# EAGLE schematic PC104 (EAGLE 7.4.0)

## Sheet 1 of 5
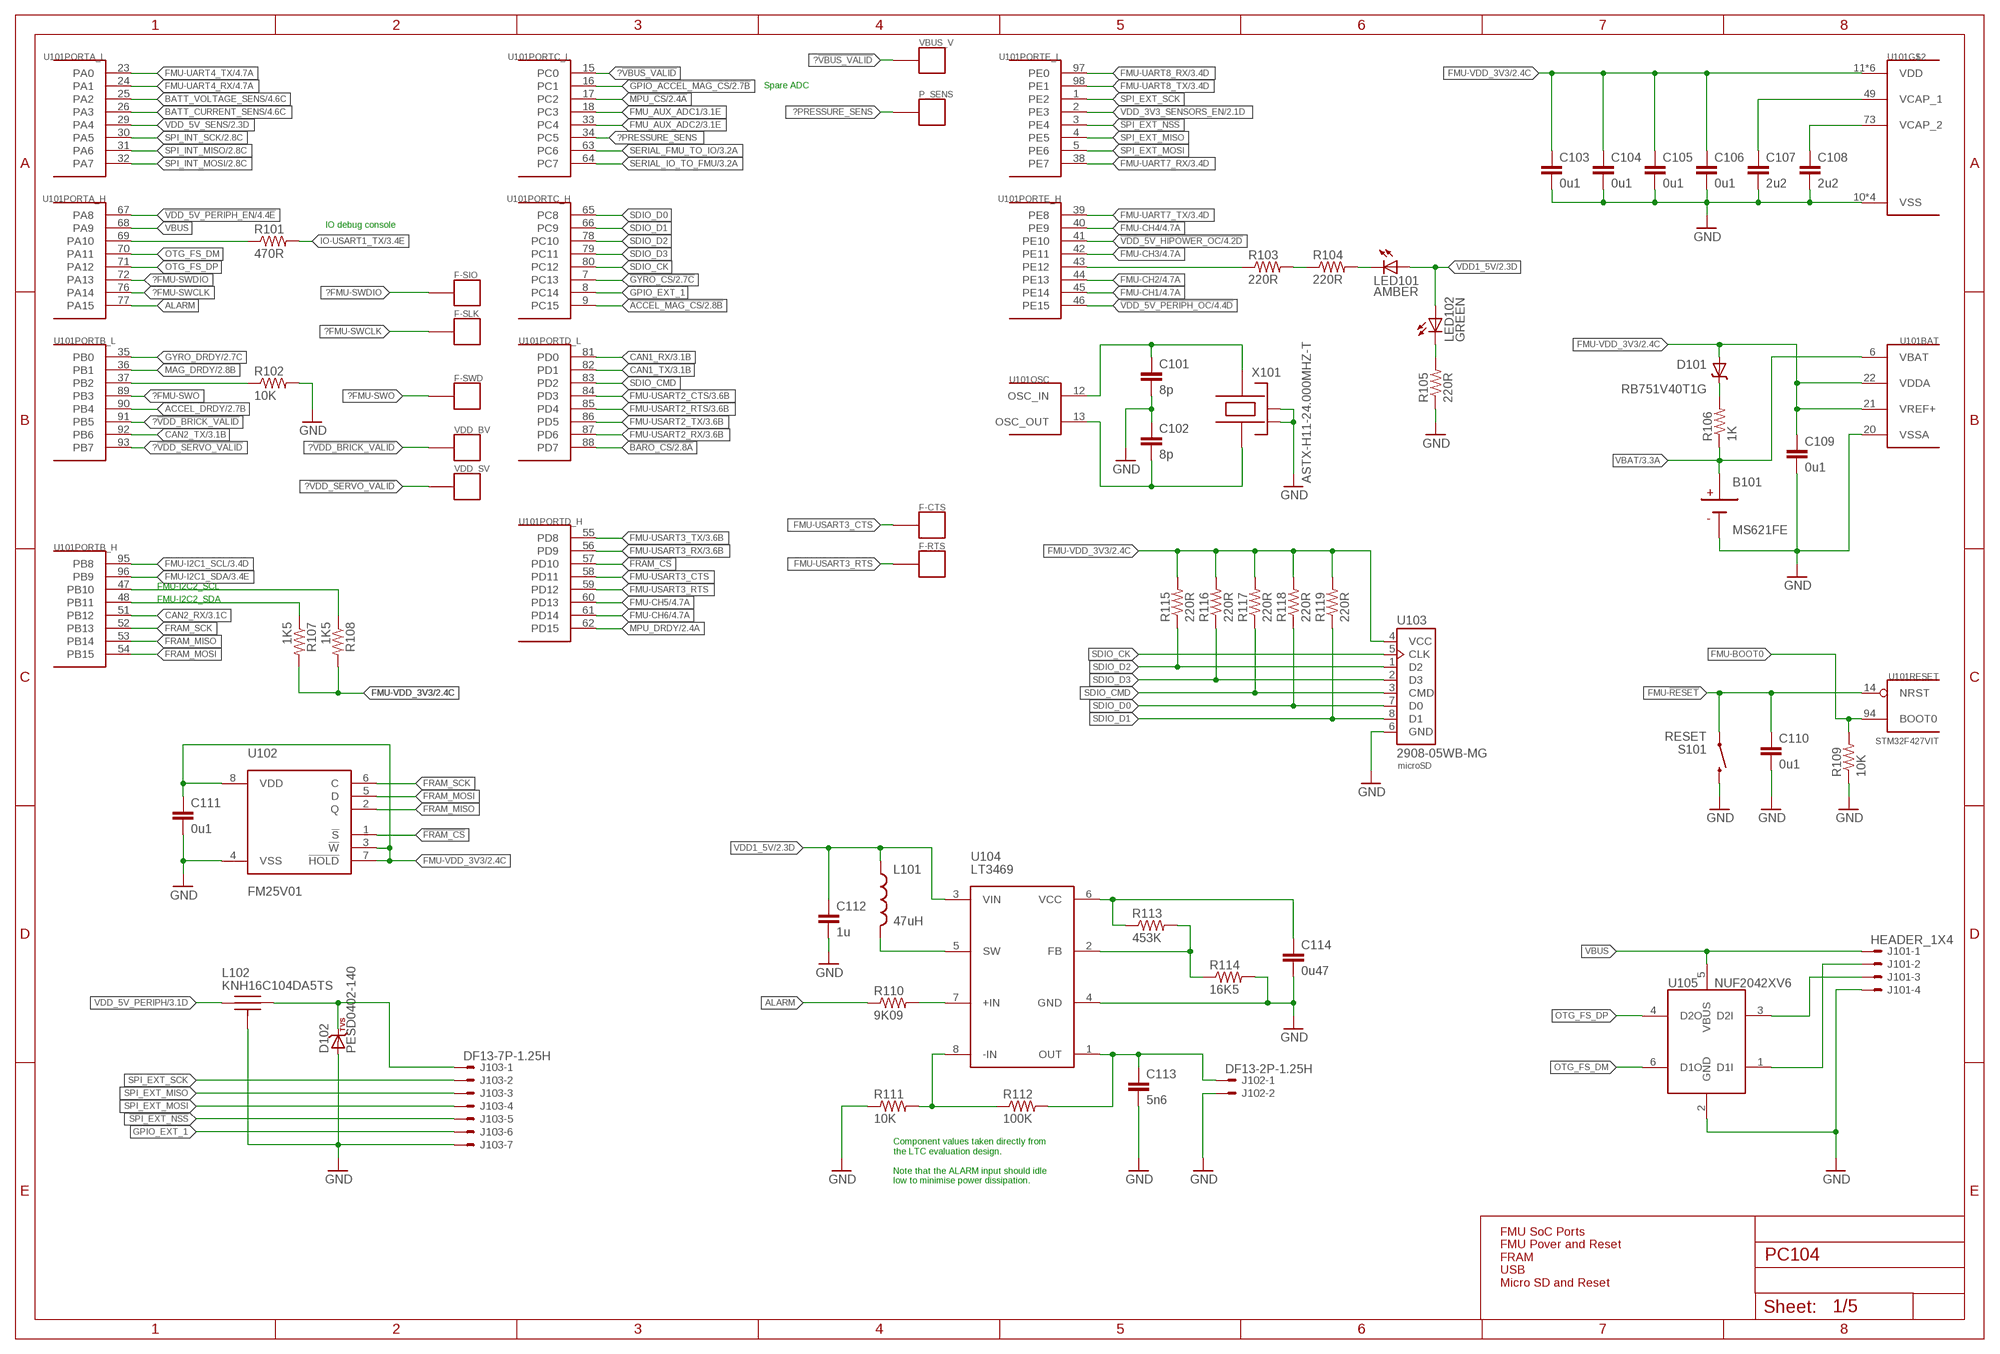
[diagram p0: schematic, sheet 1]

### Parts
B101  MS621FE  [MS621FE]
C101  8p  CAP0603  [0603-CAP]
C102  8p  CAP0603  [0603-CAP]
C103  0u1  CAP0603  [0603-CAP]
C104  0u1  CAP0603  [0603-CAP]
C105  0u1  CAP0603  [0603-CAP]
C106  0u1  CAP0603  [0603-CAP]
C107  2u2  CAP0603  [0603-CAP]
C108  2u2  CAP0603  [0603-CAP]
C109  0u1  CAP0603  [0603-CAP]
C110  0u1  CAP0603  [0603-CAP]
C111  0u1  CAP0603  [0603-CAP]
C112  1u  CAP0603  [0603-CAP]
C113  5n6  CAP0603  [0603-CAP]
C114  0u47  CAP0603  [0603-CAP]
D101  RB751V40T1G  DIODE-SCHOTTKY_SOD323  [SOD323]
D102  PESD0402-140  DIODE-TVS  [0402-TVS]
F-CTS  PAD.04  [PAD.04X.04]
F-RTS  PAD.04  [PAD.04X.04]
F-SIO  PAD.04  [PAD.04X.04]
F-SLK  PAD.04  [PAD.04X.04]
F-SWD  PAD.04  [PAD.04X.04]
J101  HEADER_1X4  [HEADER_2.54MM-1X04]
J102  DF13-2P-1.25H  [DF13A-2P-1.25H]
J103  DF13-7P-1.25H  [DF13A-7P-1.25H]
L101  47uH  INDUCTOR0805  [0805-IND]
L102  KNH16C104DA5TS  [KYOCERA-KNH16-DA]
LED101  AMBER  LED0603  [0603-LED]
LED102  GREEN  LED0603  [0603-LED]
P_SENS  PAD.04  [PAD.04X.04]
R101  470R  RESISTOR0603-RES  [0603-RES]
R102  10K  RESISTOR0603-RES  [0603-RES]
R103  220R  RESISTOR0603-RES  [0603-RES]
R104  220R  RESISTOR0603-RES  [0603-RES]
R105  220R  RESISTOR0603-RES  [0603-RES]
R106  1K  RESISTOR0603-RES  [0603-RES]
R107  1K5  RESISTOR0603-RES  [0603-RES]
R108  1K5  RESISTOR0603-RES  [0603-RES]
R109  10K  RESISTOR0603-RES  [0603-RES]
R110  9K09  RESISTOR0603-RES  [0603-RES]
R111  10K  RESISTOR0603-RES  [0603-RES]
R112  100K  RESISTOR0603-RES  [0603-RES]
R113  453K  RESISTOR0603-RES  [0603-RES]
R114  16K5  RESISTOR0603-RES  [0603-RES]
R115  220R  RESISTOR0603-RES  [0603-RES]
R116  220R  RESISTOR0603-RES  [0603-RES]
R117  220R  RESISTOR0603-RES  [0603-RES]
R118  220R  RESISTOR0603-RES  [0603-RES]
R119  220R  RESISTOR0603-RES  [0603-RES]
S101  RESET  SWITCH-MOMENTARY-2  [EVQP7J01K]
U101  STM32F427VIT  STM32F4X7VX  [TQFP100]
U102  FM25V01  [SO08]
U103  2908-05WB-MG  MICROSDSDI  [MICROSD]
U104  LT3469  [SOT23-8]
U105  NUF2042XV6  [SOT563-6]
VBUS_V  PAD.04  [PAD.04X.04]
VDD_BV  PAD.04  [PAD.04X.04]
VDD_SV  PAD.04  [PAD.04X.04]
X101  ASTX-H11-24.000MHZ-T  OSCILLATOR-3.2X2.5  [OSCILLATOR-3.2X2.5]

### Nets
!ACCEL_MAG_CS: U101.9(PORTC_H:PC15) ; also sheet 2
!BARO_CS: U101.88(PORTD_L:PD7) ; also sheet 2
!FRAM_CS: U101.57(PORTD_H:PD10) U102.1(!S)
!GPIO_ACCEL_MAG_CS: U101.16(PORTC_L:PC1) ; also sheet 2
!GYRO_CS: U101.7(PORTC_H:PC13) ; also sheet 2
!MPU_CS: U101.17(PORTC_L:PC2) ; also sheet 2
!SPI_EXT_NSS: J103.5 U101.3(PORTE_L:PE4)
!VDD_5V_HIPOWER_OC: U101.41(PORTE_H:PE10) ; also sheet 4
!VDD_5V_PERIPH_EN: U101.67(PORTA_H:PA8) ; also sheet 4
!VDD_5V_PERIPH_OC: U101.46(PORTE_H:PE15) ; also sheet 4
?!VBUS_VALID: U101.15(PORTC_L:PC0) VBUS_V.P$1
?!VDD_BRICK_VALID: U101.91(PORTB_L:PB5) VDD_BV.P$1
?!VDD_SERVO_VALID: U101.93(PORTB_L:PB7) VDD_SV.P$1
?FMU-SWCLK: F-SLK.P$1 U101.76(PORTA_H:PA14)
?FMU-SWDIO: F-SIO.P$1 U101.72(PORTA_H:PA13)
?FMU-SWO: F-SWD.P$1 U101.89(PORTB_L:PB3)
?PRESSURE_SENS: P_SENS.P$1 U101.34(PORTC_L:PC5)
ACCEL_DRDY: U101.90(PORTB_L:PB4) ; also sheet 2
ALARM: R110.1 U101.77(PORTA_H:PA15)
BATT_CURRENT_SENS: U101.26(PORTA_L:PA3) ; also sheet 4
BATT_VOLTAGE_SENS: U101.25(PORTA_L:PA2) ; also sheet 4
CAN1_RX: U101.81(PORTD_L:PD0) ; also sheet 3
CAN1_TX: U101.82(PORTD_L:PD1) ; also sheet 3
CAN2_RX: U101.51(PORTB_H:PB12) ; also sheet 3
CAN2_TX: U101.92(PORTB_L:PB6) ; also sheet 3
FMU-!RESET: C110.P$1 S101.A1 U101.14(RESET:NRST)
FMU-BOOT0: R109.2 U101.94(RESET:BOOT0)
FMU-CH1: U101.45(PORTE_H:PE14) ; also sheet 4
FMU-CH2: U101.44(PORTE_H:PE13) ; also sheet 4
FMU-CH3: U101.42(PORTE_H:PE11) ; also sheet 4
FMU-CH4: U101.40(PORTE_H:PE9) ; also sheet 4
FMU-CH5: U101.60(PORTD_H:PD13) ; also sheet 4
FMU-CH6: U101.61(PORTD_H:PD14) ; also sheet 4
FMU-I2C1_SCL: U101.95(PORTB_H:PB8) ; also sheet 3
FMU-I2C1_SDA: U101.96(PORTB_H:PB9) ; also sheet 3
FMU-UART4_RX: U101.24(PORTA_L:PA1) ; also sheet 4
FMU-UART4_TX: U101.23(PORTA_L:PA0) ; also sheet 4
FMU-UART7_RX: U101.38(PORTE_L:PE7) ; also sheet 3
FMU-UART7_TX: U101.39(PORTE_H:PE8) ; also sheet 3
FMU-UART8_RX: U101.97(PORTE_L:PE0) ; also sheet 3
FMU-UART8_TX: U101.98(PORTE_L:PE1) ; also sheet 3
FMU-USART2_CTS: U101.84(PORTD_L:PD3) ; also sheet 3
FMU-USART2_RTS: U101.85(PORTD_L:PD4) ; also sheet 3
FMU-USART2_RX: U101.87(PORTD_L:PD6) ; also sheet 3
FMU-USART2_TX: U101.86(PORTD_L:PD5) ; also sheet 3
FMU-USART3_CTS: F-CTS.P$1 U101.58(PORTD_H:PD11)
FMU-USART3_RTS: F-RTS.P$1 U101.59(PORTD_H:PD12)
FMU-USART3_RX: U101.56(PORTD_H:PD9) ; also sheet 3
FMU-USART3_TX: U101.55(PORTD_H:PD8) ; also sheet 3
FMU-VDD_3V3 [GND1]: C103.P$1 C104.P$1 C105.P$1 C106.P$1 C109.P$1 C111.P$1 D101.A R107.2 R108.2 R115.2 R116.2 R117.2 R118.2 R119.2 U101.11(VDD) U101.19(VDD) U101.21(BAT:VREF+) U101.22(BAT:VDDA) U101.28(VDD) U101.50(VDD) U101.75(VDD) U101.100(VDD) U102.3(!W) U102.7(!HOLD) U102.8(VDD) U103.4(VCC) ; also sheet 2,3,4
FMU_AUX_ADC1: U101.18(PORTC_L:PC3) ; also sheet 3
FMU_AUX_ADC2: U101.33(PORTC_L:PC4) ; also sheet 3
FRAM_MISO: U101.53(PORTB_H:PB14) U102.2(Q)
FRAM_MOSI: U101.54(PORTB_H:PB15) U102.5(D)
FRAM_SCK: U101.52(PORTB_H:PB13) U102.6(C)
GND: B101.2(NEG) C101.P$2 C102.P$1 C103.P$2 C104.P$2 C105.P$2 C106.P$2 C107.P$2 C108.P$2 C109.P$2 C110.P$2 C111.P$2 C112.P$2 C113.P$2 C114.P$2 D102.A J101.4 J102.2 J103.7 L102.P$3 L102.P$4 L102.P$5 R102.2 R105.1 R109.1 R111.1 R114.2 S101.B3 U101.10(VSS) U101.20(BAT:VSSA) U101.27(VSS) U101.74(VSS) U101.99(VSS) U102.4(VSS) U103.6(GND) U104.4(GND) U105.2(GND) X101.2(NC_2) X101.4(NC_4) ; also sheet 2,3,4
GPIO_EXT_1: J103.6 U101.8(PORTC_H:PC14)
GYRO_DRDY: U101.35(PORTB_L:PB0) ; also sheet 2
IO-USART1_TX: R101.2 ; also sheet 3
MAG_DRDY: U101.36(PORTB_L:PB1) ; also sheet 2
MPU_DRDY: U101.62(PORTD_H:PD15) ; also sheet 2
N$1: J101.3 U105.3(D2I)
N$2: C108.P$1 U101.73(VCAP_2)
N$3: C102.P$2 U101.13(OSC:OSC_OUT) X101.1
N$4: C101.P$1 U101.12(OSC:OSC_IN) X101.3
N$5: C107.P$1 U101.49(VCAP_1)
N$6: J101.2 U105.1(D1I)
N$7: R101.1 U101.69(PORTA_H:PA10)
N$9: D101.C R106.2
N$10: R102.1 U101.37(PORTB_L:PB2)
N$14: R103.1 U101.43(PORTE_H:PE12)
N$29: C114.P$1 R113.1 U104.6(VCC)
N$30: R113.2 R114.1 U104.2(FB)
N$32: L101.P$2 U104.5(SW)
N$41: R103.2 R104.1
N$42: LED101.C R104.2
N$43: LED102.C R105.2
N$48: R111.2 R112.1 U104.8(-IN)
N$49: C113.P$1 J102.1 R112.2 U104.1(OUT)
N$52: R110.2 U104.7(+IN)
N$63: R108.1 U101.47(PORTB_H:PB10)
N$64: R107.1 U101.48(PORTB_H:PB11)
N$67: D102.C J103.1 L102.P$2
OTG_FS_DM: U101.70(PORTA_H:PA11) U105.6(D1O)
OTG_FS_DP: U101.71(PORTA_H:PA12) U105.4(D2O)
SDIO_CK: U101.80(PORTC_H:PC12) U103.5(CLK)
SDIO_CMD: R117.1 U101.83(PORTD_L:PD2) U103.3(CMD)
SDIO_D0: R118.1 U101.65(PORTC_H:PC8) U103.7(D0)
SDIO_D1: R119.1 U101.66(PORTC_H:PC9) U103.8(D1)
SDIO_D2: R115.1 U101.78(PORTC_H:PC10) U103.1(D2)
SDIO_D3: R116.1 U101.79(PORTC_H:PC11) U103.2(D3)
SERIAL_FMU_TO_IO: U101.63(PORTC_L:PC6) ; also sheet 3
SERIAL_IO_TO_FMU: U101.64(PORTC_L:PC7) ; also sheet 3
SPI_EXT_MISO: J103.3 U101.4(PORTE_L:PE5)
SPI_EXT_MOSI: J103.4 U101.5(PORTE_L:PE6)
SPI_EXT_SCK: J103.2 U101.1(PORTE_L:PE2)
SPI_INT_MISO: U101.31(PORTA_L:PA6) ; also sheet 2
SPI_INT_MOSI: U101.32(PORTA_L:PA7) ; also sheet 2
SPI_INT_SCK: U101.30(PORTA_L:PA5) ; also sheet 2
VBAT: B101.1(POS) R106.1 U101.6(BAT:VBAT) ; also sheet 3
VBUS: J101.1 U101.68(PORTA_H:PA9) U105.5(VBUS)
VDD1_5V: C112.P$1 L101.P$1 LED101.A LED102.A U104.3(VIN) ; also sheet 2,3,4
VDD_3V3_SENSORS_EN: U101.2(PORTE_L:PE3) ; also sheet 2
VDD_5V_PERIPH: L102.P$1 ; also sheet 3,4
VDD_5V_SENS: U101.29(PORTA_L:PA4) ; also sheet 2

### Notes on the sheet
- Spare ADC
- IO debug console
- FMU-I2C2_SCL
- FMU-I2C2_SDA
- microSD
- Component values taken directly from
  the LTC evaluation design.
  
  Note that the ALARM input should idle
  low to minimise power dissipation.
- FMU SoC Ports
  FMU Pover and Reset
  FRAM
  USB
  Micro SD and Reset

## Sheet 2 of 5
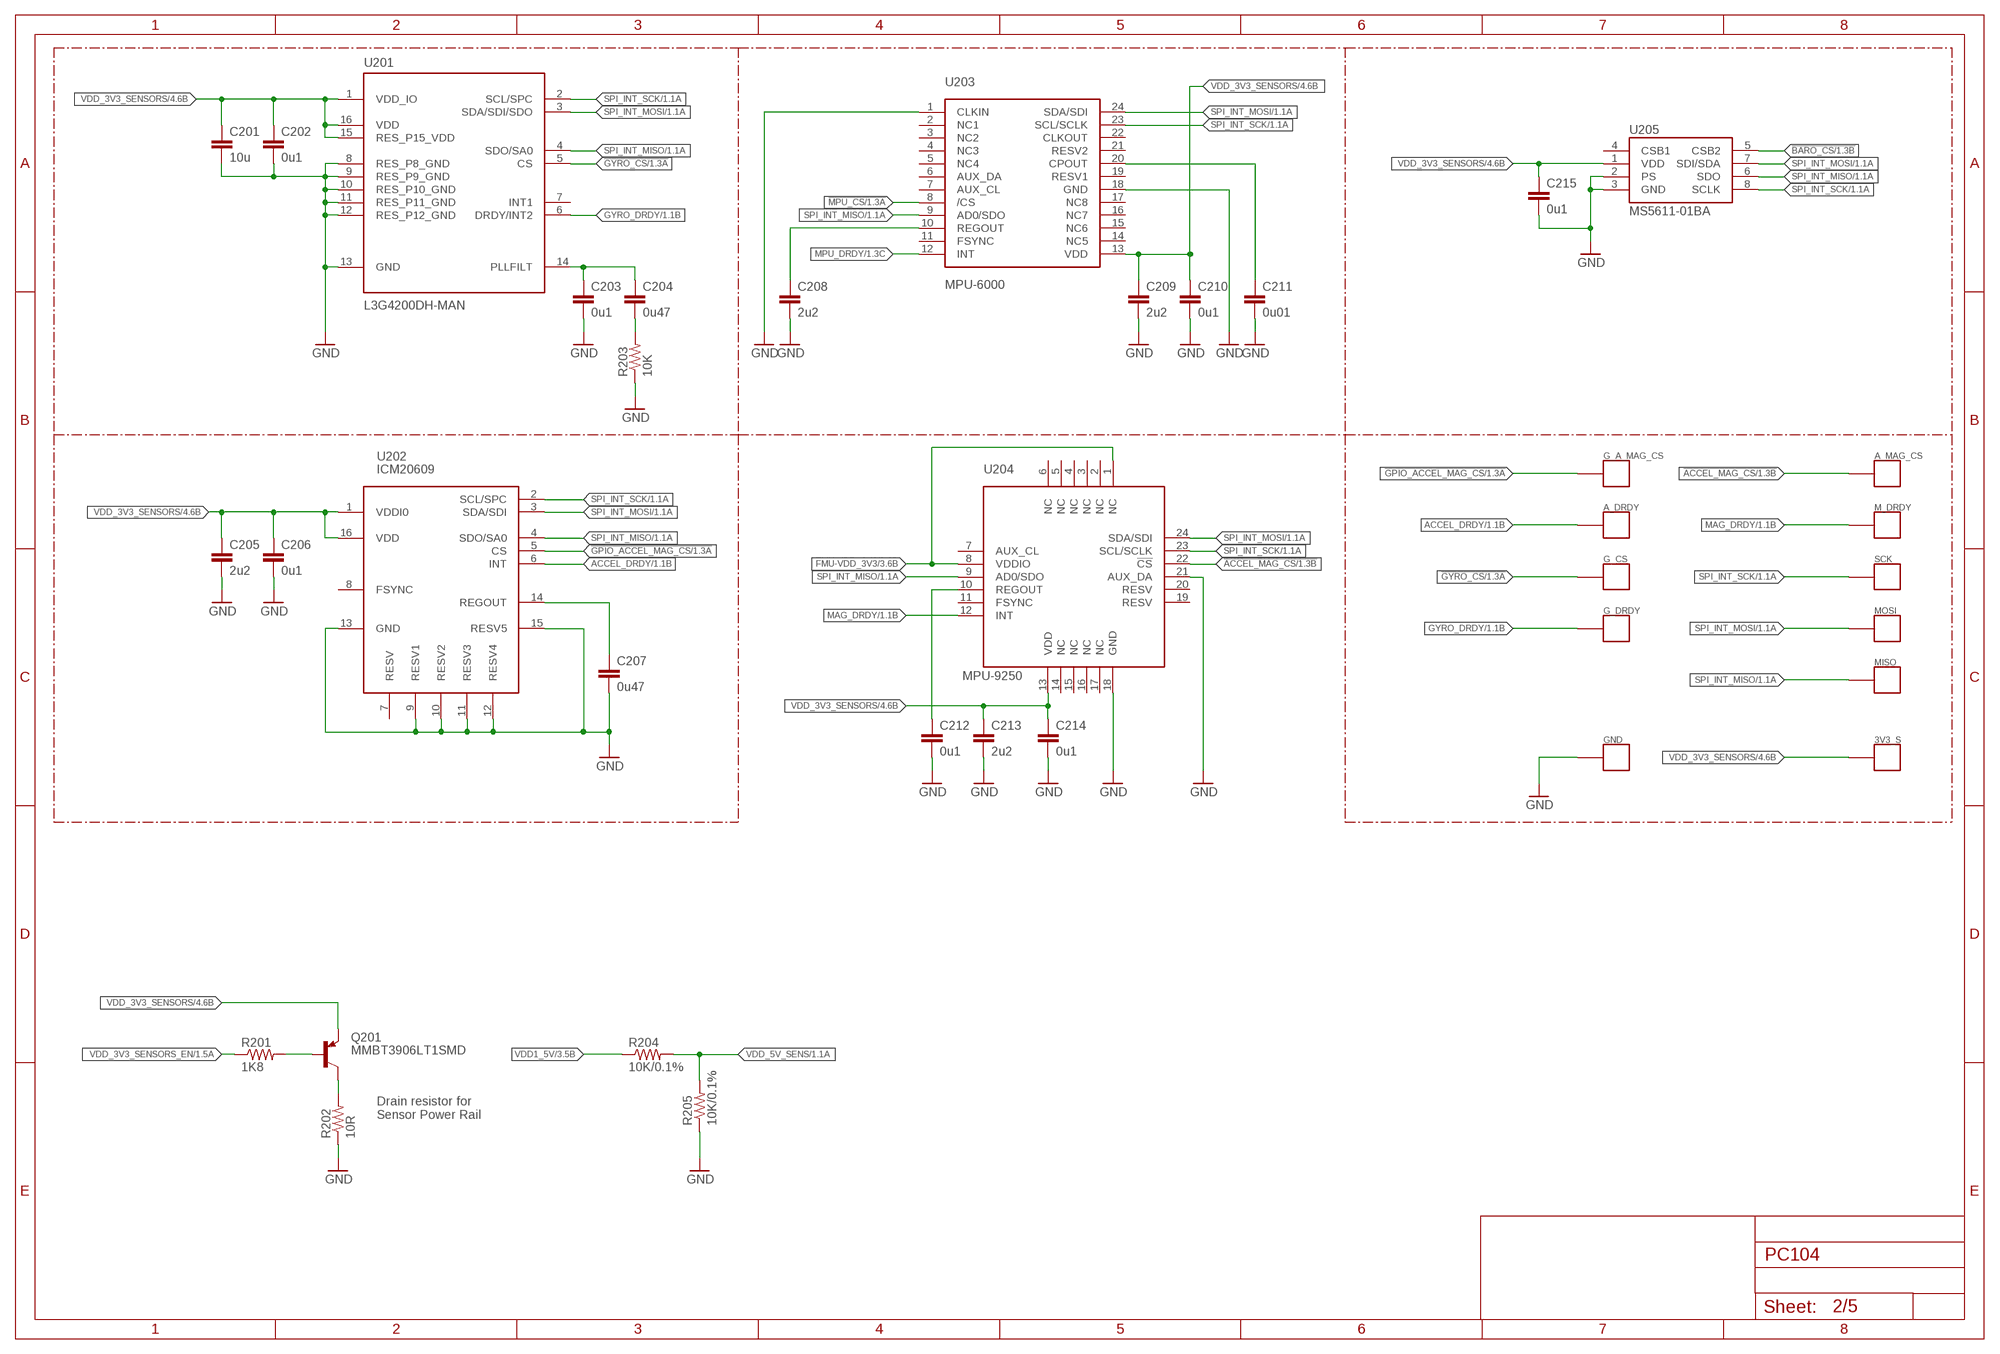
[diagram p1: schematic, sheet 2]

### Parts
3V3_S  PAD.04  [PAD.04X.04]
A_DRDY  PAD.04  [PAD.04X.04]
A_MAG_CS  PAD.04  [PAD.04X.04]
C201  10u  CAP0805  [0805-CAP]
C202  0u1  CAP0603  [0603-CAP]
C203  0u1  CAP0603  [0603-CAP]
C204  0u47  CAP0603  [0603-CAP]
C205  2u2  CAP0603  [0603-CAP]
C206  0u1  CAP0603  [0603-CAP]
C207  0u47  CAP0603  [0603-CAP]
C208  2u2  CAP0603  [0603-CAP]
C209  2u2  CAP0603  [0603-CAP]
C210  0u1  CAP0603  [0603-CAP]
C211  0u01  CAP0603  [0603-CAP]
C212  0u1  CAP0603  [0603-CAP]
C213  2u2  CAP0603  [0603-CAP]
C214  0u1  CAP0603  [0603-CAP]
C215  0u1  CAP0603  [0603-CAP]
G_A_MAG_CS  PAD.04  [PAD.04X.04]
G_CS  PAD.04  [PAD.04X.04]
G_DRDY  PAD.04  [PAD.04X.04]
GND  PAD.04  [PAD.04X.04]
M_DRDY  PAD.04  [PAD.04X.04]
MISO  PAD.04  [PAD.04X.04]
MOSI  PAD.04  [PAD.04X.04]
Q201  MMBT3906LT1SMD  [SOT23-BEC]
R201  1K8  RESISTOR0603-RES  [0603-RES]
R202  10R  RESISTOR0603-RES  [0603-RES]
R203  10K  RESISTOR0603-RES  [0603-RES]
R204  10K/0.1%  RESISTOR0603-RES  [0603-RES]
R205  10K/0.1%  RESISTOR0603-RES  [0603-RES]
SCK  PAD.04  [PAD.04X.04]
U201  L3G4200DH-MAN  L3G4200DH-LL  [L3G4200DH-MAN]
U202  ICM20609  ICM20609ICM20609  [LGA-16-3PX5P]
U203  MPU-6000  [QFN-24]
U204  MPU-9250  MPU-6500  [MPU-6500]
U205  MS5611-01BA  [MS5611-01BA]

### Nets
!ACCEL_MAG_CS: A_MAG_CS.P$1 U204.22(!CS) ; also sheet 1
!BARO_CS: U205.5(CSB2) ; also sheet 1
!GPIO_ACCEL_MAG_CS: G_A_MAG_CS.P$1 U202.5(CS) ; also sheet 1
!GYRO_CS: G_CS.P$1 U201.5(CS) ; also sheet 1
!MPU_CS: U203.8(/CS) ; also sheet 1
ACCEL_DRDY: A_DRDY.P$1 U202.6(INT) ; also sheet 1
FMU-VDD_3V3 [GND1]: U204.1(NC) U204.8(VDDIO) ; also sheet 1,3,4
GND: C201.P$2 C202.P$2 C203.P$2 C205.P$2 C206.P$2 C207.P$2 C208.P$2 C209.P$2 C210.P$2 C211.P$2 C212.P$2 C213.P$2 C214.P$2 C215.P$2 GND.P$1 R202.1 R203.1 R205.1 U201.8(RES_P8_GND) U201.9(RES_P9_GND) U201.10(RES_P10_GND) U201.11(RES_P11_GND) U201.12(RES_P12_GND) U201.13(GND) U202.9(RESV1) U202.10(RESV2) U202.11(RESV3) U202.12(RESV4) U202.13(GND) U202.15(RESV5) U203.1(CLKIN) U203.18(GND) U204.18(GND) U204.21(AUX_DA) U205.2(PS) U205.3(GND) ; also sheet 1,3,4
GYRO_DRDY: G_DRDY.P$1 U201.6(DRDY/INT2) ; also sheet 1
MAG_DRDY: M_DRDY.P$1 U204.12(INT) ; also sheet 1
MPU_DRDY: U203.12(INT) ; also sheet 1
N$20: C204.P$2 R203.2
N$36: Q201.B R201.2
N$40: Q201.C R202.2
N$53: C211.P$1 U203.20(CPOUT)
N$54: C203.P$1 C204.P$1 U201.14(PLLFILT)
N$55: C208.P$1 U203.10(REGOUT)
N$56: C212.P$1 U204.10(REGOUT)
N$62: C207.P$1 U202.14(REGOUT)
SPI_INT_MISO: MISO.P$1 U201.4(SDO/SA0) U202.4(SDO/SA0) U203.9(AD0/SDO) U204.9(AD0/SDO) U205.6(SDO) ; also sheet 1
SPI_INT_MOSI: MOSI.P$1 U201.3(SDA/SDI/SDO) U202.3(SDA/SDI) U203.24(SDA/SDI) U204.24(SDA/SDI) U205.7(SDI/SDA) ; also sheet 1
SPI_INT_SCK: SCK.P$1 U201.2(SCL/SPC) U202.2(SCL/SPC) U203.23(SCL/SCLK) U204.23(SCL/SCLK) U205.8(SCLK) ; also sheet 1
VDD1_5V: R204.1 ; also sheet 1,3,4
VDD_3V3_SENSORS: 3V3_S.P$1 C201.P$1 C202.P$1 C205.P$1 C206.P$1 C209.P$1 C210.P$1 C213.P$1 C214.P$1 C215.P$1 Q201.E U201.1(VDD_IO) U201.15(RES_P15_VDD) U201.16(VDD) U202.1(VDDI0) U202.16(VDD) U203.13(VDD) U204.13(VDD) U205.1(VDD) ; also sheet 4
VDD_3V3_SENSORS_EN: R201.1 ; also sheet 1
VDD_5V_SENS: R204.2 R205.2 ; also sheet 1
Unconnected: U201.7(INT1) U202.7(RESV) U202.8(FSYNC) U203.2(NC1) U203.3(NC2) U203.4(NC3) U203.5(NC4) U203.6(AUX_DA) U203.7(AUX_CL) U203.11(FSYNC) U203.14(NC5) U203.15(NC6) U203.16(NC7) U203.17(NC8) U203.19(RESV1) U203.21(RESV2) U203.22(CLKOUT) U204.2(NC) U204.3(NC) U204.4(NC) U204.5(NC) U204.6(NC) U204.7(AUX_CL) U204.11(FSYNC) U204.14(NC) U204.15(NC) U204.16(NC) U204.17(NC) U204.19(RESV) U204.20(RESV) U205.4(CSB1)

### Notes on the sheet
- Drain resistor for 
  Sensor Power Rail

## Sheet 3 of 5
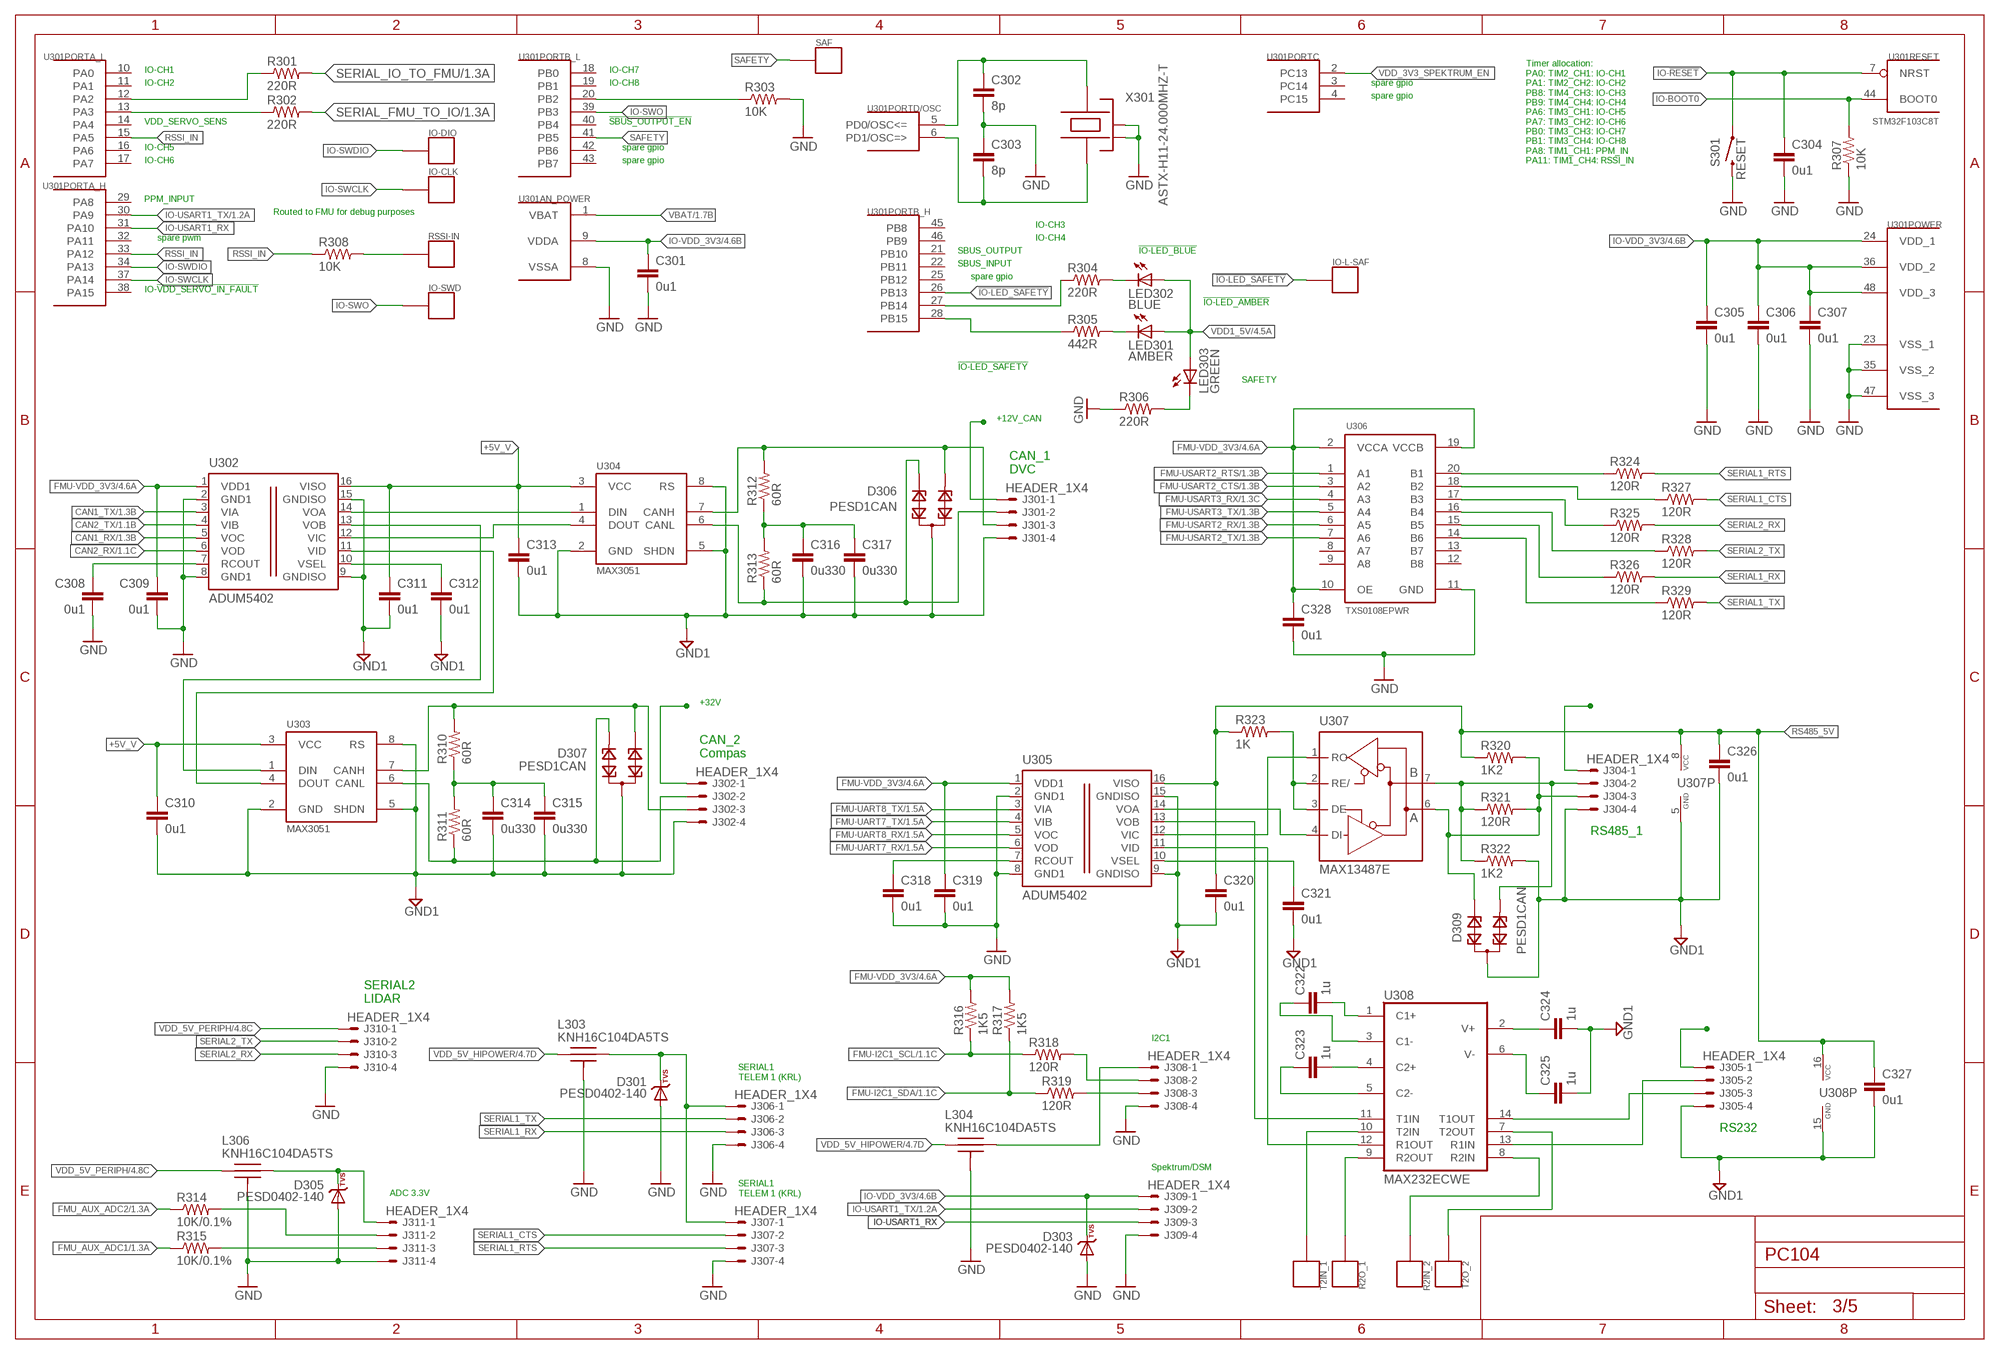
[diagram p2: schematic, sheet 3]

### Parts
C301  0u1  CAP0603  [0603-CAP]
C302  8p  CAP0603  [0603-CAP]
C303  8p  CAP0603  [0603-CAP]
C304  0u1  CAP0603  [0603-CAP]
C305  0u1  CAP0603  [0603-CAP]
C306  0u1  CAP0603  [0603-CAP]
C307  0u1  CAP0603  [0603-CAP]
C308  0u1  CAP0603  [0603-CAP]
C309  0u1  CAP0603  [0603-CAP]
C310  0u1  CAP0603  [0603-CAP]
C311  0u1  CAP0603  [0603-CAP]
C312  0u1  CAP0603  [0603-CAP]
C313  0u1  CAP0603  [0603-CAP]
C314  0u330  CAP1210  [1210]
C315  0u330  CAP1210  [1210]
C316  0u330  CAP1210  [1210]
C317  0u330  CAP1210  [1210]
C318  0u1  CAP0603  [0603-CAP]
C319  0u1  CAP0603  [0603-CAP]
C320  0u1  CAP0603  [0603-CAP]
C321  0u1  CAP0603  [0603-CAP]
C322  1u  CAP0603  [0603-CAP]
C323  1u  CAP0603  [0603-CAP]
C324  1u  CAP0603  [0603-CAP]
C325  1u  CAP0603  [0603-CAP]
C326  0u1  CAP0603  [0603-CAP]
C327  0u1  CAP0603  [0603-CAP]
C328  0u1  CAP0603  [0603-CAP]
D301  PESD0402-140  DIODE-TVS  [0402-TVS]
D303  PESD0402-140  DIODE-TVS  [0402-TVS]
D305  PESD0402-140  DIODE-TVS  [0402-TVS]
D306  PESD1CAN  [SOT23@1]
D307  PESD1CAN  [SOT23@1]
D309  PESD1CAN  [SOT23@1]
IO-CLK  PAD.04  [PAD.04X.04]
IO-DIO  TP31  PAD.04  [PAD.04X.04]
IO-L-SAF  PAD.04  [PAD.04X.04]
IO-SWD  PAD.04  [PAD.04X.04]
J301  HEADER_1X4  [HEADER_2.54MM-1X04]
J302  HEADER_1X4  [HEADER_2.54MM-1X04]
J304  HEADER_1X4  [HEADER_2.54MM-1X04]
J305  HEADER_1X4  [HEADER_2.54MM-1X04]
J306  HEADER_1X4  [HEADER_2.54MM-1X04]
J307  HEADER_1X4  [HEADER_2.54MM-1X04]
J308  HEADER_1X4  [HEADER_2.54MM-1X04]
J309  HEADER_1X4  [HEADER_2.54MM-1X04]
J310  HEADER_1X4  [HEADER_2.54MM-1X04]
J311  HEADER_1X4  [HEADER_2.54MM-1X04]
L303  KNH16C104DA5TS  [KYOCERA-KNH16-DA]
L304  KNH16C104DA5TS  [KYOCERA-KNH16-DA]
L306  KNH16C104DA5TS  [KYOCERA-KNH16-DA]
LED301  AMBER  LED0603  [0603-LED]
LED302  BLUE  LED0603  [0603-LED]
LED303  GREEN  LED0603  [0603-LED]
R2IN_2  PAD.04  [PAD.04X.04]
R2O_1  PAD.04  [PAD.04X.04]
R301  220R  RESISTOR0603-RES  [0603-RES]
R302  220R  RESISTOR0603-RES  [0603-RES]
R303  10K  RESISTOR0603-RES  [0603-RES]
R304  220R  RESISTOR0603-RES  [0603-RES]
R305  442R  RESISTOR0603-RES  [0603-RES]
R306  220R  RESISTOR0603-RES  [0603-RES]
R307  10K  RESISTOR0603-RES  [0603-RES]
R308  10K  RESISTOR0603-RES  [0603-RES]
R310  60R  RESISTOR0603-RES  [0603-RES]
R311  60R  RESISTOR0603-RES  [0603-RES]
R312  60R  RESISTOR0603-RES  [0603-RES]
R313  60R  RESISTOR0603-RES  [0603-RES]
R314  10K/0.1%  RESISTOR0603-RES  [0603-RES]
R315  10K/0.1%  RESISTOR0603-RES  [0603-RES]
R316  1K5  RESISTOR0603-RES  [0603-RES]
R317  1K5  RESISTOR0603-RES  [0603-RES]
R318  120R  RESISTOR0603-RES  [0603-RES]
R319  120R  RESISTOR0603-RES  [0603-RES]
R320  1K2  RESISTOR0603-RES  [0603-RES]
R321  120R  RESISTOR0603-RES  [0603-RES]
R322  1K2  RESISTOR0603-RES  [0603-RES]
R323  1K  RESISTOR0603-RES  [0603-RES]
R324  120R  RESISTOR0603-RES  [0603-RES]
R325  120R  RESISTOR0603-RES  [0603-RES]
R326  120R  RESISTOR0603-RES  [0603-RES]
R327  120R  RESISTOR0603-RES  [0603-RES]
R328  120R  RESISTOR0603-RES  [0603-RES]
R329  120R  RESISTOR0603-RES  [0603-RES]
RSSI-IN  PAD.04  [PAD.04X.04]
S301  RESET  SWITCH-MOMENTARY-2  [EVQP7J01K]
SAF  PAD.04  [PAD.04X.04]
T2IN_1  T2IN  PAD.04  [PAD.04X.04]
T2O_2  PAD.04  [PAD.04X.04]
U301  STM32F103C8T  STM32F10XCXT6  [TQFP48]
U302  ADUM5402  ADUM1301  [SO-16W]
U303  MAX3051  MAX3051MAX3051ESA  [SO08]
U304  MAX3051  MAX3051MAX3051ESA  [SO08]
U305  ADUM5402  ADUM1301  [SO-16W]
U306  TXS0108EPWR  TXS0108TSSOP-20  [R-PDSO-G20]
U307  MAX13487E  MAX481CSA  [SO08]
U308  MAX232ECWE  [SO16L]
X301  ASTX-H11-24.000MHZ-T  OSCILLATOR-3.2X2.5  [OSCILLATOR-3.2X2.5]

### Nets
!IO-LED_SAFETY: IO-L-SAF.P$1 U301.26(PORTB_H:PB13)
+5V: J305.1
+5V_V: C310.P$1 C311.P$1 C313.P$1 U302.16(VISO) U303.3(VCC) U304.3(VCC)
+12V: J304.1
+12V_CAN: J301.1
+32V_CAN: J302.1
CAN1_RX: U302.5(VOC) ; also sheet 1
CAN1_TX: U302.3(VIA) ; also sheet 1
CAN2_RX: U302.6(VOD) ; also sheet 1
CAN2_RX_IN: U302.11(VID) U303.4(DOUT)
CAN2_TX: U302.4(VIB) ; also sheet 1
CAN2_TX_IN: U302.13(VOB) U303.1(DIN)
FMU-I2C1_SCL: R316.1 R318.1 ; also sheet 1
FMU-I2C1_SDA: R317.1 R319.1 ; also sheet 1
FMU-UART7_RX: U305.6(VOD) ; also sheet 1
FMU-UART7_TX: U305.4(VIB) ; also sheet 1
FMU-UART8_RX: U305.5(VOC) ; also sheet 1
FMU-UART8_TX: U305.3(VIA) ; also sheet 1
FMU-USART2_CTS: U306.3(A2) ; also sheet 1
FMU-USART2_RTS: U306.1(A1) ; also sheet 1
FMU-USART2_RX: U306.6(A5) ; also sheet 1
FMU-USART2_TX: U306.7(A6) ; also sheet 1
FMU-USART3_RX: U306.4(A3) ; also sheet 1
FMU-USART3_TX: U306.5(A4) ; also sheet 1
FMU-VDD_3V3 [GND1]: C309.P$1 C319.P$1 C328.P$1 R316.2 R317.2 U302.1(VDD1) U305.1(VDD1) U306.2(VCCA) U306.10(OE) U306.19(VCCB) ; also sheet 1,2,4
FMU_AUX_ADC1: R315.1 ; also sheet 1
FMU_AUX_ADC2: R314.1 ; also sheet 1
GND: C301.P$2 C302.P$2 C303.P$1 C304.P$2 C305.P$2 C306.P$2 C307.P$2 C308.P$2 C309.P$2 C318.P$2 C319.P$2 C328.P$2 D301.A D303.A D305.A J306.4 J307.4 J308.4 J309.4 J310.4 J311.4 L303.P$3 L303.P$4 L303.P$5 L304.P$3 L304.P$4 L304.P$5 L306.P$3 L306.P$4 L306.P$5 R303.2 R306.1 R307.1 S301.B3 U301.8(AN_POWER:VSSA) U301.23(POWER:VSS_1) U301.35(POWER:VSS_2) U301.47(POWER:VSS_3) U302.2(GND1) U302.8(GND1) U305.2(GND1) U305.8(GND1) U306.11(GND) X301.2(NC_2) X301.4(NC_4) ; also sheet 1,2,4
GND1 [GND1]: C310.P$2 C311.P$2 C312.P$2 C313.P$2 C314.2 C315.2 C316.2 C317.2 C320.P$2 C321.P$2 C324.P$2 C325.P$2 C326.P$2 C327.P$2 D306.3 D307.3 D309.3 J301.4 J302.4 J304.4 J305.4 R322.2 U302.9(GNDISO) U302.15(GNDISO) U303.2(GND) U303.5(SHDN) U303.8(RS) U304.2(GND) U304.5(SHDN) U304.8(RS) U305.9(GNDISO) U305.15(GNDISO) U307.5(GND) U308.15(GND)
IO-!RESET: C304.P$1 S301.A1 U301.7(RESET:NRST)
IO-BOOT0: R307.2 U301.44(RESET:BOOT0)
IO-SWCLK: IO-CLK.P$1 U301.37(PORTA_H:PA14)
IO-SWDIO: IO-DIO.P$1 U301.34(PORTA_H:PA13)
IO-SWO: IO-SWD.P$1 U301.39(PORTB_L:PB3)
IO-USART1_RX: J309.3 U301.31(PORTA_H:PA10)
IO-USART1_TX: J309.2 U301.30(PORTA_H:PA9) ; also sheet 1
IO-VDD_3V3: C301.P$1 C305.P$1 C306.P$1 C307.P$1 D303.C J309.1 U301.9(AN_POWER:VDDA) U301.24(POWER:VDD_1) U301.36(POWER:VDD_2) U301.48(POWER:VDD_3) ; also sheet 4
N$8: R301.1 U301.12(PORTA_L:PA2)
N$11: R302.1 U301.13(PORTA_L:PA3)
N$12: R303.1 U301.20(PORTB_L:PB2)
N$13: C303.P$2 U301.6(PORTD/OSC:PD1/OSC=>) X301.1
N$16: D309.1 J304.3 R320.2 R321.2 U307.6(A)
N$17: J305.2 U308.13(R1IN)
N$18: D309.2 J304.2 R321.1 R322.1 U307.7(B)
N$19: R308.2 RSSI-IN.P$1
N$21: C308.P$1 U302.7(RCOUT)
N$24: LED303.C R306.2
N$25: J311.3 R315.2
N$26: C312.P$1 U302.10(VSEL)
N$28: D301.C J306.1 J307.1 L303.P$2
N$33: C323.P$2 U308.4(C2+)
N$34: R304.1 U301.27(PORTB_H:PB14)
N$37: C316.1 C317.1 R312.1 R313.2
N$38: J308.2 R318.2
N$39: C323.P$1 U308.5(C2-)
N$44: LED301.C R305.2
N$45: J308.3 R319.2
N$46: R305.1 U301.28(PORTB_H:PB15)
N$47: LED302.C R304.2
N$50: R328.1 U306.16(B4)
N$51: R326.1 U306.15(B5)
N$57: C322.P$2 U308.1(C1+)
N$58: C322.P$1 U308.3(C1-)
N$59: J305.3 U308.14(T1OUT)
N$60: J308.1 L304.P$2
N$61: D305.C J311.1 L306.P$2
N$65: R325.1 U306.17(B3)
N$66: R327.1 U306.18(B2)
N$68: C318.P$1 U305.7(RCOUT)
N$70: R329.1 U306.14(B6)
N$71: R324.1 U306.20(B1)
N$72: J311.2 R314.2
N$73: C321.P$1 U305.10(VSEL)
N$74: C324.P$1 U308.2(V+)
N$75: C314.1 C315.1 R310.1 R311.2
N$82: D306.1 J301.2 R313.1 U304.6(CANL)
N$83: D306.2 J301.3 R312.2 U304.7(CANH)
N$84: D307.1 J302.3 R310.2 U303.7(CANH)
N$85: D307.2 J302.2 R311.1 U303.6(CANL)
N$86: C325.P$1 U308.6(V-)
N$104: R323.2 U307.2(RE/) U307.3(DE)
N$106: T2IN_1.P$1 U308.10(T2IN)
N$110: R2O_1.P$1 U308.9(R2OUT)
N$111: T2O_2.P$1 U308.7(T2OUT)
N$127: R2IN_2.P$1 U308.8(R2IN)
N$145: U302.14(VOA) U304.1(DIN)
N$147: U302.12(VIC) U304.4(DOUT)
RS485_5V: C320.P$1 C326.P$1 C327.P$1 R320.1 R323.1 U305.16(VISO) U307.8(VCC) U308.16(VCC)
RSSI_IN: R308.1 U301.15(PORTA_L:PA5) U301.33(PORTA_H:PA12)
SAFETY: SAF.P$1 U301.41(PORTB_L:PB5)
SERIAL1_CTS: J307.2 R327.2
SERIAL1_RTS: J307.3 R324.2
SERIAL1_RX: J306.3 R326.2
SERIAL1_TX: J306.2 R329.2
SERIAL2_RX: J310.3 R325.2
SERIAL2_TX: J310.2 R328.2
SERIAL_FMU_TO_IO: R302.2 ; also sheet 1
SERIAL_IO_TO_FMU: R301.2 ; also sheet 1
VBAT: U301.1(AN_POWER:VBAT) ; also sheet 1
VDD1_5V: LED301.A LED302.A LED303.A ; also sheet 1,2,4
VDD_3V3_SPEKTRUM_EN: U301.2(PORTC:PC13)
VDD_5V_HIPOWER: L303.P$1 L304.P$1 ; also sheet 4
VDD_5V_PERIPH: J310.1 L306.P$1 ; also sheet 1,4
VIC: U305.12(VIC) U307.1(RO)
VID: U305.11(VID) U308.12(R1OUT)
VOA: U305.14(VOA) U307.4(DI)
VOB: U305.13(VOB) U308.11(T1IN)
X301: C302.P$1 U301.5(PORTD/OSC:PD0/OSC<=) X301.3
Unconnected: U301.3(PORTC:PC14) U301.4(PORTC:PC15) U301.10(PORTA_L:PA0) U301.11(PORTA_L:PA1) U301.14(PORTA_L:PA4) U301.16(PORTA_L:PA6) U301.17(PORTA_L:PA7) U301.18(PORTB_L:PB0) U301.19(PORTB_L:PB1) U301.21(PORTB_H:PB10) U301.22(PORTB_H:PB11) U301.25(PORTB_H:PB12) U301.29(PORTA_H:PA8) U301.32(PORTA_H:PA11) U301.38(PORTA_H:PA15) U301.40(PORTB_L:PB4) U301.42(PORTB_L:PB6) U301.43(PORTB_L:PB7) U301.45(PORTB_H:PB8) U301.46(PORTB_H:PB9) U306.8(A7) U306.9(A8) U306.12(B8) U306.13(B7)

### Notes on the sheet
- IO-CH1 | IO-CH7
- IO-CH2 | IO-CH8 | spare gpio
- spare gpio
- VDD_SERVO_SENS | !SBUS_OUTPUT_EN
- IO-CH5 | spare gpio
- IO-CH6 | spare gpio
- Timer allocation:
  PA0: TIM2_CH1: IO-CH1
  PA1: TIM2_CH2: IO-CH2
  PB8: TIM4_CH3: IO-CH3
  PB9: TIM4_CH4: IO-CH4
  PA6: TIM3_CH1: IO-CH5
  PA7: TIM3_CH2: IO-CH6
  PB0: TIM3_CH3: IO-CH7
  PB1: TIM3_CH4: IO-CH8
  PA8: TIM1_CH1: PPM_IN
  PA11: TIM1_CH4: RSSI_IN
- PPM_INPUT
- Routed to FMU for debug purposes
- IO-CH3
- spare pwm | IO-CH4
- SBUS_OUTPUT | !IO-LED_BLUE
- SBUS_INPUT
- spare gpio
- IO-!VDD_SERVO_IN_FAULT
- !IO-LED_AMBER
- !IO-LED_SAFETY
- SAFETY
- +12V_CAN
- CAN_1
  DVC
- +32V
- CAN_2
  Compas
- RS485_1
- SERIAL2
  LIDAR
- I2C1
- SERIAL1
  TELEM 1 (KRL)
- RS232
- Spektrum/DSM
- ADC 3.3V
- SERIAL1
  TELEM 1 (KRL)

## Sheet 4 of 5
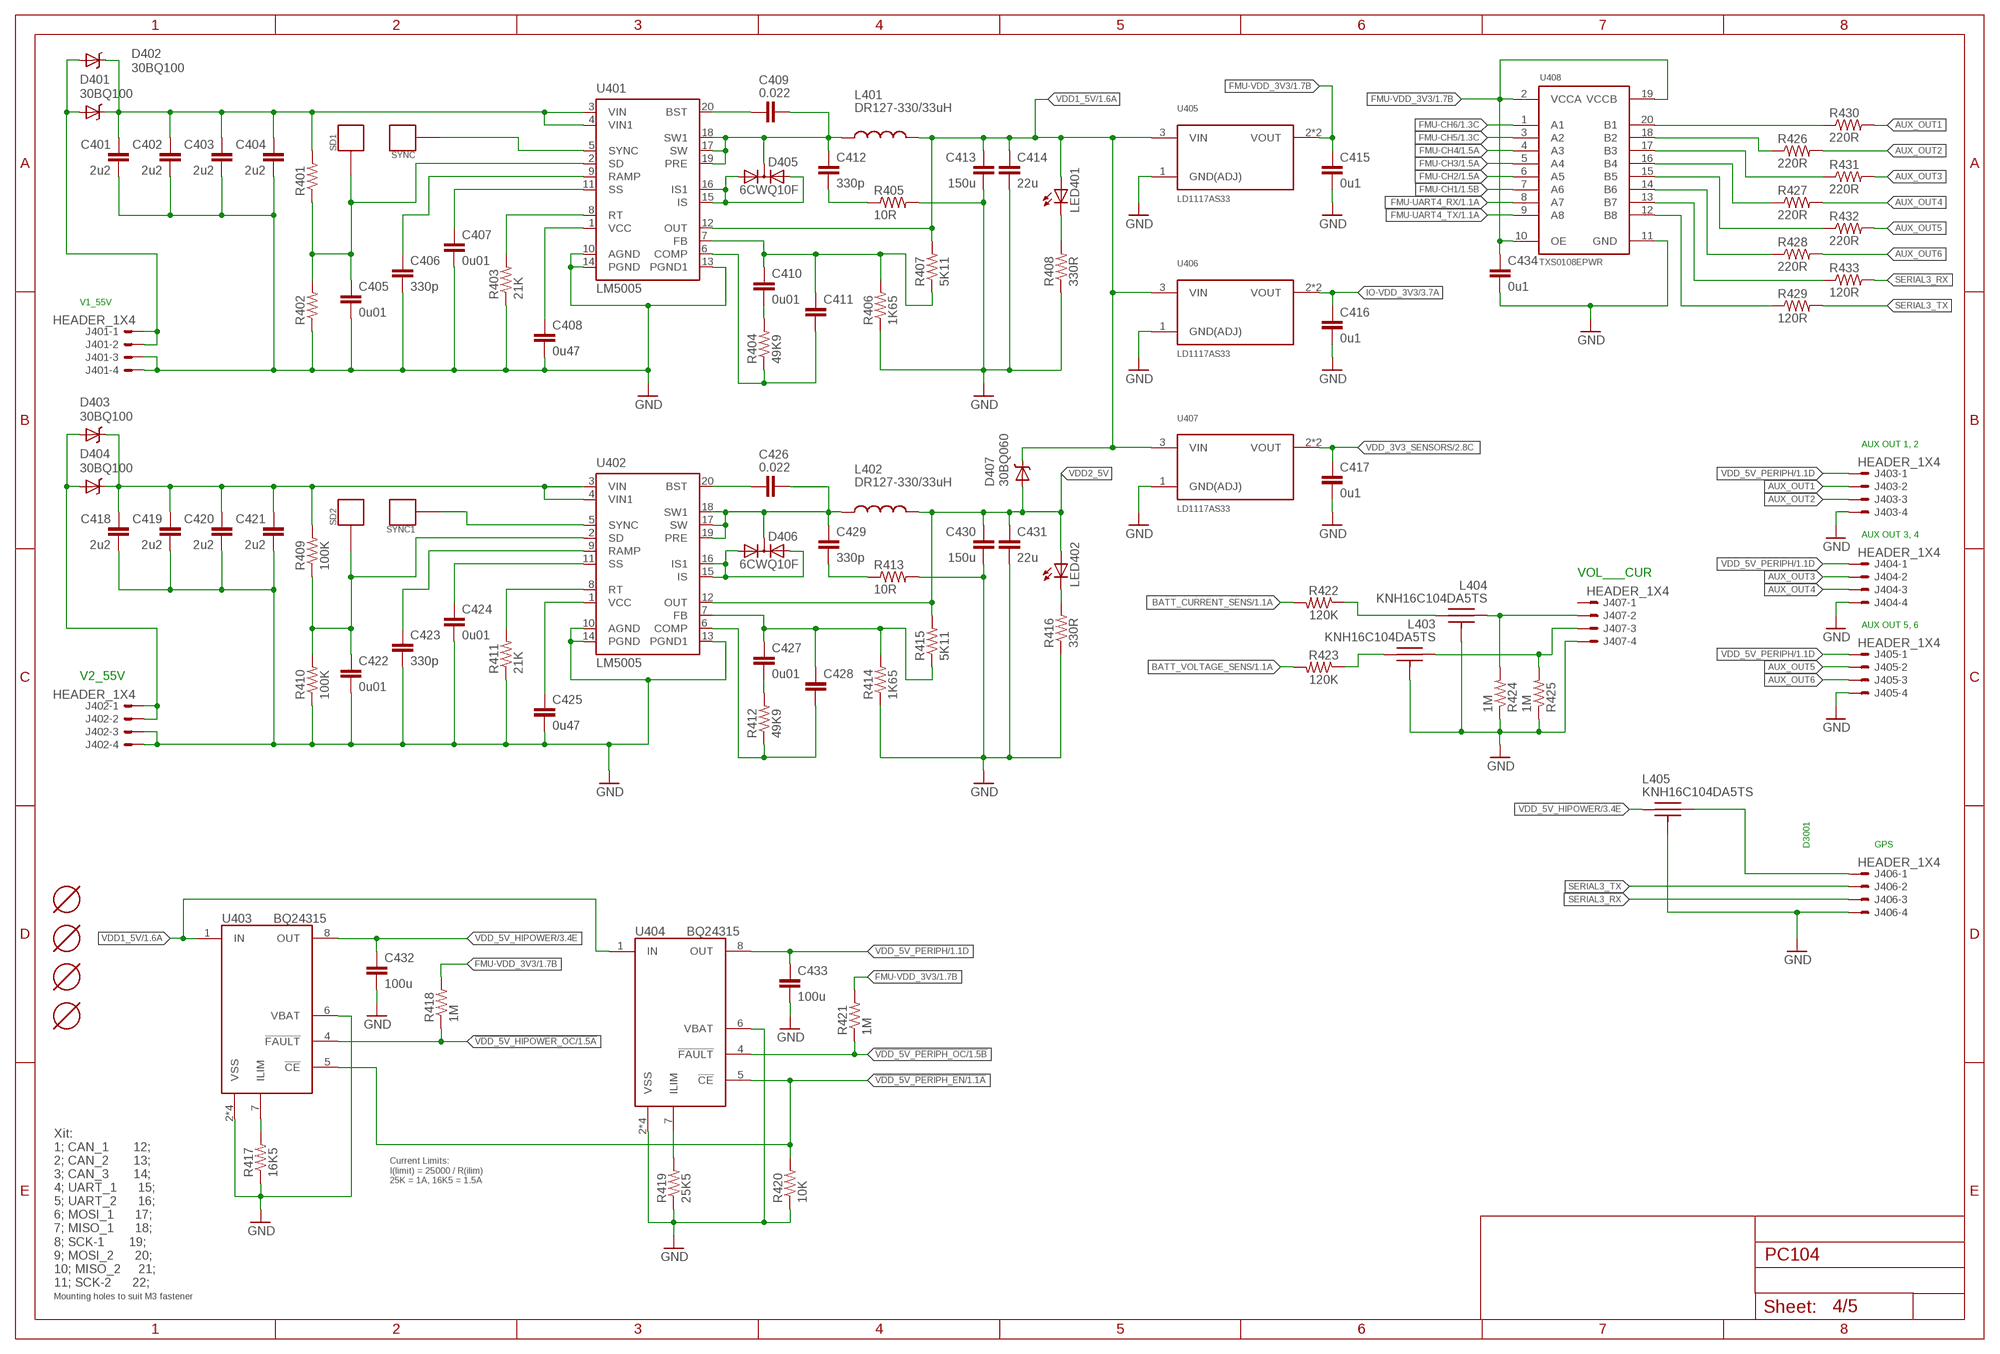
[diagram p3: schematic, sheet 4]

### Parts
C401  2u2  CAP1812  [1812-CAP]
C402  2u2  CAP1812  [1812-CAP]
C403  2u2  CAP1812  [1812-CAP]
C404  2u2  CAP1812  [1812-CAP]
C405  0u01  CAP0805  [0805-CAP]
C406  330p  CAP0805  [0805-CAP]
C407  0u01  CAP0805  [0805-CAP]
C408  0u47  CAP0805  [0805-CAP]
C409  0.022  CAP0805  [0805-CAP]
C410  0u01  CAP0805  [0805-CAP]
C411  CAP0805  [0805-CAP]
C412  330p  CAP0805  [0805-CAP]
C413  150u  CAP1206  [1206-CAP]
C414  22u  CAP1206  [1206-CAP]
C415  0u1  CAP0805  [0805-CAP]
C416  0u1  CAP0805  [0805-CAP]
C417  0u1  CAP0805  [0805-CAP]
C418  2u2  CAP1812  [1812-CAP]
C419  2u2  CAP1812  [1812-CAP]
C420  2u2  CAP1812  [1812-CAP]
C421  2u2  CAP1812  [1812-CAP]
C422  0u01  CAP0805  [0805-CAP]
C423  330p  CAP0805  [0805-CAP]
C424  0u01  CAP0805  [0805-CAP]
C425  0u47  CAP0805  [0805-CAP]
C426  0.022  CAP0805  [0805-CAP]
C427  0u01  CAP0805  [0805-CAP]
C428  CAP0805  [0805-CAP]
C429  330p  CAP0805  [0805-CAP]
C430  150u  CAP1206  [1206-CAP]
C431  22u  CAP1206  [1206-CAP]
C432  100u  CAP1206  [1206-CAP]
C433  100u  CAP1206  [1206-CAP]
C434  0u1  CAP0603  [0603-CAP]
D401  30BQ100  DIODE-SCHOTTKY_SMA  [SMA-DIODE]
D402  30BQ100  DIODE-SCHOTTKY_SMA  [SMA-DIODE]
D403  30BQ100  DIODE-SCHOTTKY_SMA  [SMA-DIODE]
D404  30BQ100  DIODE-SCHOTTKY_SMA  [SMA-DIODE]
D405  6CWQ10F  DIODE-2AC|CASOT23  [SOT23]
D406  6CWQ10F  DIODE-2AC|CASOT23  [SOT23]
D407  30BQ060  DIODE-SCHOTTKY_SMA  [SMA-DIODE]
J401  HEADER_1X4  [HEADER_2.54MM-1X04]
J402  HEADER_1X4  [HEADER_2.54MM-1X04]
J403  HEADER_1X4  [HEADER_2.54MM-1X04]
J404  HEADER_1X4  [HEADER_2.54MM-1X04]
J405  HEADER_1X4  [HEADER_2.54MM-1X04]
J406  HEADER_1X4  [HEADER_2.54MM-1X04]
J407  HEADER_1X4  [HEADER_2.54MM-1X04]
L401  DR127-330/33uH  SLF10145  [SLF10145]
L402  DR127-330/33uH  SLF10145  [SLF10145]
L403  KNH16C104DA5TS  [KYOCERA-KNH16-DA]
L404  KNH16C104DA5TS  [KYOCERA-KNH16-DA]
L405  KNH16C104DA5TS  [KYOCERA-KNH16-DA]
LED401  LED0603  [0603-LED]
LED402  LED0603  [0603-LED]
R401  RESISTOR0805  [0805]
R402  RESISTOR0805  [0805]
R403  21K  RESISTOR0805  [0805]
R404  49K9  RESISTOR0805  [0805]
R405  10R  RESISTOR2512  [R2512]
R406  1K65  RESISTOR0805  [0805]
R407  5K11  RESISTOR0805  [0805]
R408  330R  RESISTOR0805  [0805]
R409  100K  RESISTOR0805  [0805]
R410  100K  RESISTOR0805  [0805]
R411  21K  RESISTOR0805  [0805]
R412  49K9  RESISTOR0805  [0805]
R413  10R  RESISTOR2512  [R2512]
R414  1K65  RESISTOR0805  [0805]
R415  5K11  RESISTOR0805  [0805]
R416  330R  RESISTOR0805  [0805]
R417  16K5  RESISTOR0603-RES  [0603-RES]
R418  1M  RESISTOR0603-RES  [0603-RES]
R419  25K5  RESISTOR0603-RES  [0603-RES]
R420  10K  RESISTOR0603-RES  [0603-RES]
R421  1M  RESISTOR0603-RES  [0603-RES]
R422  120K  RESISTOR0603-RES  [0603-RES]
R423  120K  RESISTOR0603-RES  [0603-RES]
R424  1M  RESISTOR0603-RES  [0603-RES]
R425  1M  RESISTOR0603-RES  [0603-RES]
R426  220R  RESISTOR0603-RES  [0603-RES]
R427  220R  RESISTOR0603-RES  [0603-RES]
R428  220R  RESISTOR0603-RES  [0603-RES]
R429  120R  RESISTOR0603-RES  [0603-RES]
R430  220R  RESISTOR0603-RES  [0603-RES]
R431  220R  RESISTOR0603-RES  [0603-RES]
R432  220R  RESISTOR0603-RES  [0603-RES]
R433  120R  RESISTOR0603-RES  [0603-RES]
SD1  CYNC  PAD.03  [PAD.03X.03]
SD2  CYNC  PAD.03  [PAD.03X.03]
SYNC  CYNC  PAD.03  [PAD.03X.03]
SYNC1  CYNC  PAD.03  [PAD.03X.03]
U401  LM5005  [TSSOP20]
U402  LM5005  [TSSOP20]
U403  BQ24315  [QFN8-DSG]
U404  BQ24315  [QFN8-DSG]
U405  LD1117AS33  [SOT-223]
U406  LD1117AS33  [SOT-223]
U407  LD1117AS33  [SOT-223]
U408  TXS0108EPWR  TXS0108TSSOP-20  [R-PDSO-G20]
U$1  MOUNT-HOLE  [MOUNT-HOLE3.3]
U$2  MOUNT-HOLE  [MOUNT-HOLE3.3]
U$3  MOUNT-HOLE  [MOUNT-HOLE3.3]
U$4  MOUNT-HOLE  [MOUNT-HOLE3.3]

### Nets
!VDD_5V_HIPOWER_OC: R418.1 U403.4(!FAULT) ; also sheet 1
!VDD_5V_PERIPH_EN: R420.2 U403.5(!CE) U404.5(!CE) ; also sheet 1
!VDD_5V_PERIPH_OC: R421.1 U404.4(!FAULT) ; also sheet 1
+55V1: D401.A D402.A J401.1 J401.2
+55V1_V: C401.1 C402.1 C403.1 C404.1 D401.C D402.C R401.2 U401.3(VIN) U401.4(VIN1)
+55V2: D403.A D404.A J402.1 J402.2
+55V2_V: C418.1 C419.1 C420.1 C421.1 D403.C D404.C R409.2 U402.3(VIN) U402.4(VIN1)
AUX_OUT1: J403.2 R430.2
AUX_OUT2: J403.3 R426.2
AUX_OUT3: J404.2 R431.2
AUX_OUT4: J404.3 R427.2
AUX_OUT5: J405.2 R432.2
AUX_OUT6: J405.3 R428.2
BATT_CURRENT_SENS: R422.2 ; also sheet 1
BATT_VOLTAGE_SENS: R423.2 ; also sheet 1
D1_O: D405.1(A1) D405.2(A2) U401.15(IS) U401.16(IS1)
D1X: C409.P$1 C412.P$1 D405.3(C) L401.P$1 U401.17(SW) U401.18(SW1) U401.19(PRE)
D2_O: D406.1(A1) D406.2(A2) U402.15(IS) U402.16(IS1)
D2X: C426.P$1 C429.P$1 D406.3(C) L402.P$1 U402.17(SW) U402.18(SW1) U402.19(PRE)
FMU-CH1: U408.7(A6) ; also sheet 1
FMU-CH2: U408.6(A5) ; also sheet 1
FMU-CH3: U408.5(A4) ; also sheet 1
FMU-CH4: U408.4(A3) ; also sheet 1
FMU-CH5: U408.3(A2) ; also sheet 1
FMU-CH6: U408.1(A1) ; also sheet 1
FMU-UART4_RX: U408.8(A7) ; also sheet 1
FMU-UART4_TX: U408.9(A8) ; also sheet 1
FMU-VDD_3V3 [GND1]: C415.P$1 C434.P$1 R418.2 R421.2 U405.2(VOUT) U405.4(VOUT) U408.2(VCCA) U408.10(OE) U408.19(VCCB) ; also sheet 1,2,3
GND: C401.2 C402.2 C403.2 C404.2 C405.P$2 C406.P$2 C407.P$2 C408.P$2 C413.P$2 C414.P$2 C415.P$2 C416.P$2 C417.P$2 C418.2 C419.2 C420.2 C421.2 C422.P$2 C423.P$2 C424.P$2 C425.P$2 C430.P$2 C431.P$2 C432.P$2 C433.P$2 C434.P$2 J401.3 J401.4 J402.3 J402.4 J403.4 J404.4 J405.4 J406.4 J407.4 L403.P$3 L403.P$4 L403.P$5 L404.P$3 L404.P$4 L404.P$5 L405.P$3 L405.P$4 L405.P$5 R402.1 R403.1 R405.2 R406.1 R408.1 R410.1 R411.1 R413.2 R414.1 R416.1 R417.1 R419.1 R420.1 R424.1 R425.1 U401.10(AGND) U401.13(PGND1) U401.14(PGND) U402.10(AGND) U402.13(PGND1) U402.14(PGND) U403.2(VSS) U403.6(VBAT) U403.GND(VSS) U403.P$2(VSS) U403.P$3(VSS) U404.2(VSS) U404.6(VBAT) U404.GND(VSS) U404.P$2(VSS) U404.P$3(VSS) U405.1(GND(ADJ)) U406.1(GND(ADJ)) U407.1(GND(ADJ)) U408.11(GND) ; also sheet 1,2,3
GPS: J406.1 L405.P$2
IO-VDD_3V3: C416.P$1 U406.2(VOUT) U406.4(VOUT) ; also sheet 3
N$23: SYNC.P$1 U401.5(SYNC)
N$31: SYNC1.P$1 U402.5(SYNC)
N$76: L404.P$2 R422.1
N$77: L403.P$2 R423.1
N$80: J407.2 L404.P$1 R424.2
N$81: J407.3 L403.P$1 R425.2
N$87: R433.1 U408.13(B7)
N$88: C405.P$1 R401.1 R402.2 SD1.P$1 U401.2(SD)
N$91: C412.P$2 R405.1
N$92: R429.1 U408.12(B8)
N$93: LED402.C R416.2
N$95: C407.P$1 U401.11(SS)
N$96: C411.P$2 R404.1 U401.6(COMP)
N$98: R403.2 U401.8(RT)
N$99: C409.P$2 U401.20(BST)
N$101: C408.P$1 U401.1(VCC)
N$102: LED401.C R408.2
N$103: R417.2 U403.7(ILIM)
N$107: C423.P$1 U402.9(RAMP)
N$108: C410.P$1 C411.P$1 R406.2 R407.1 U401.7(FB)
N$109: C410.P$2 R404.2
N$112: C422.P$1 R409.1 R410.2 SD2.P$1 U402.2(SD)
N$113: C424.P$1 U402.11(SS)
N$115: R411.2 U402.8(RT)
N$116: C425.P$1 U402.1(VCC)
N$117: C406.P$1 U401.9(RAMP)
N$119: R430.1 U408.20(B1)
N$120: R426.1 U408.18(B2)
N$121: R431.1 U408.17(B3)
N$122: R427.1 U408.16(B4)
N$123: R432.1 U408.15(B5)
N$124: R428.1 U408.14(B6)
N$128: C426.P$2 U402.20(BST)
N$130: C428.P$2 R412.1 U402.6(COMP)
N$131: C429.P$2 R413.1
N$132: R419.2 U404.7(ILIM)
N$133: C427.P$1 C428.P$1 R414.2 R415.1 U402.7(FB)
N$134: C427.P$2 R412.2
SERIAL3_RX: J406.3 R433.2
SERIAL3_TX: J406.2 R429.2
VDD1_5V: C413.P$1 C414.P$1 D407.C L401.P$2 LED401.A R407.2 U401.12(OUT) U403.1(IN) U404.1(IN) U405.3(VIN) U406.3(VIN) U407.3(VIN) ; also sheet 1,2,3
VDD2_5V: C430.P$1 C431.P$1 D407.A L402.P$2 LED402.A R415.2 U402.12(OUT)
VDD_3V3_SENSORS: C417.P$1 U407.2(VOUT) U407.4(VOUT) ; also sheet 2
VDD_5V_HIPOWER: C432.P$1 L405.P$1 U403.8(OUT) ; also sheet 3
VDD_5V_PERIPH: C433.P$1 J403.1 J404.1 J405.1 U404.8(OUT) ; also sheet 1,3
Unconnected: J407.1

### Notes on the sheet
- V1_55V
- AUX OUT 1, 2
- AUX OUT 3, 4
- VOL___CUR
- AUX OUT 5, 6
- V2_55V
- D3001 | GPS
- Current Limits:
  I(limit) = 25000 / R(ilim)
  25K = 1A, 16K5 = 1.5A
- Xit:
  1; CAN_1       12;
  2; CAN_2       13;
  3; CAN_3       14;
  4; UART_1      15;
  5; UART_2      16;
  6; MOSI_1      17;
  7; MISO_1      18;
  8; SCK-1       19;
  9; MOSI_2      20;
  10; MISO_2     21;
  11; SCK-2      22;
- Mounting holes to suit M3 fastener

## Sheet 5 of 5
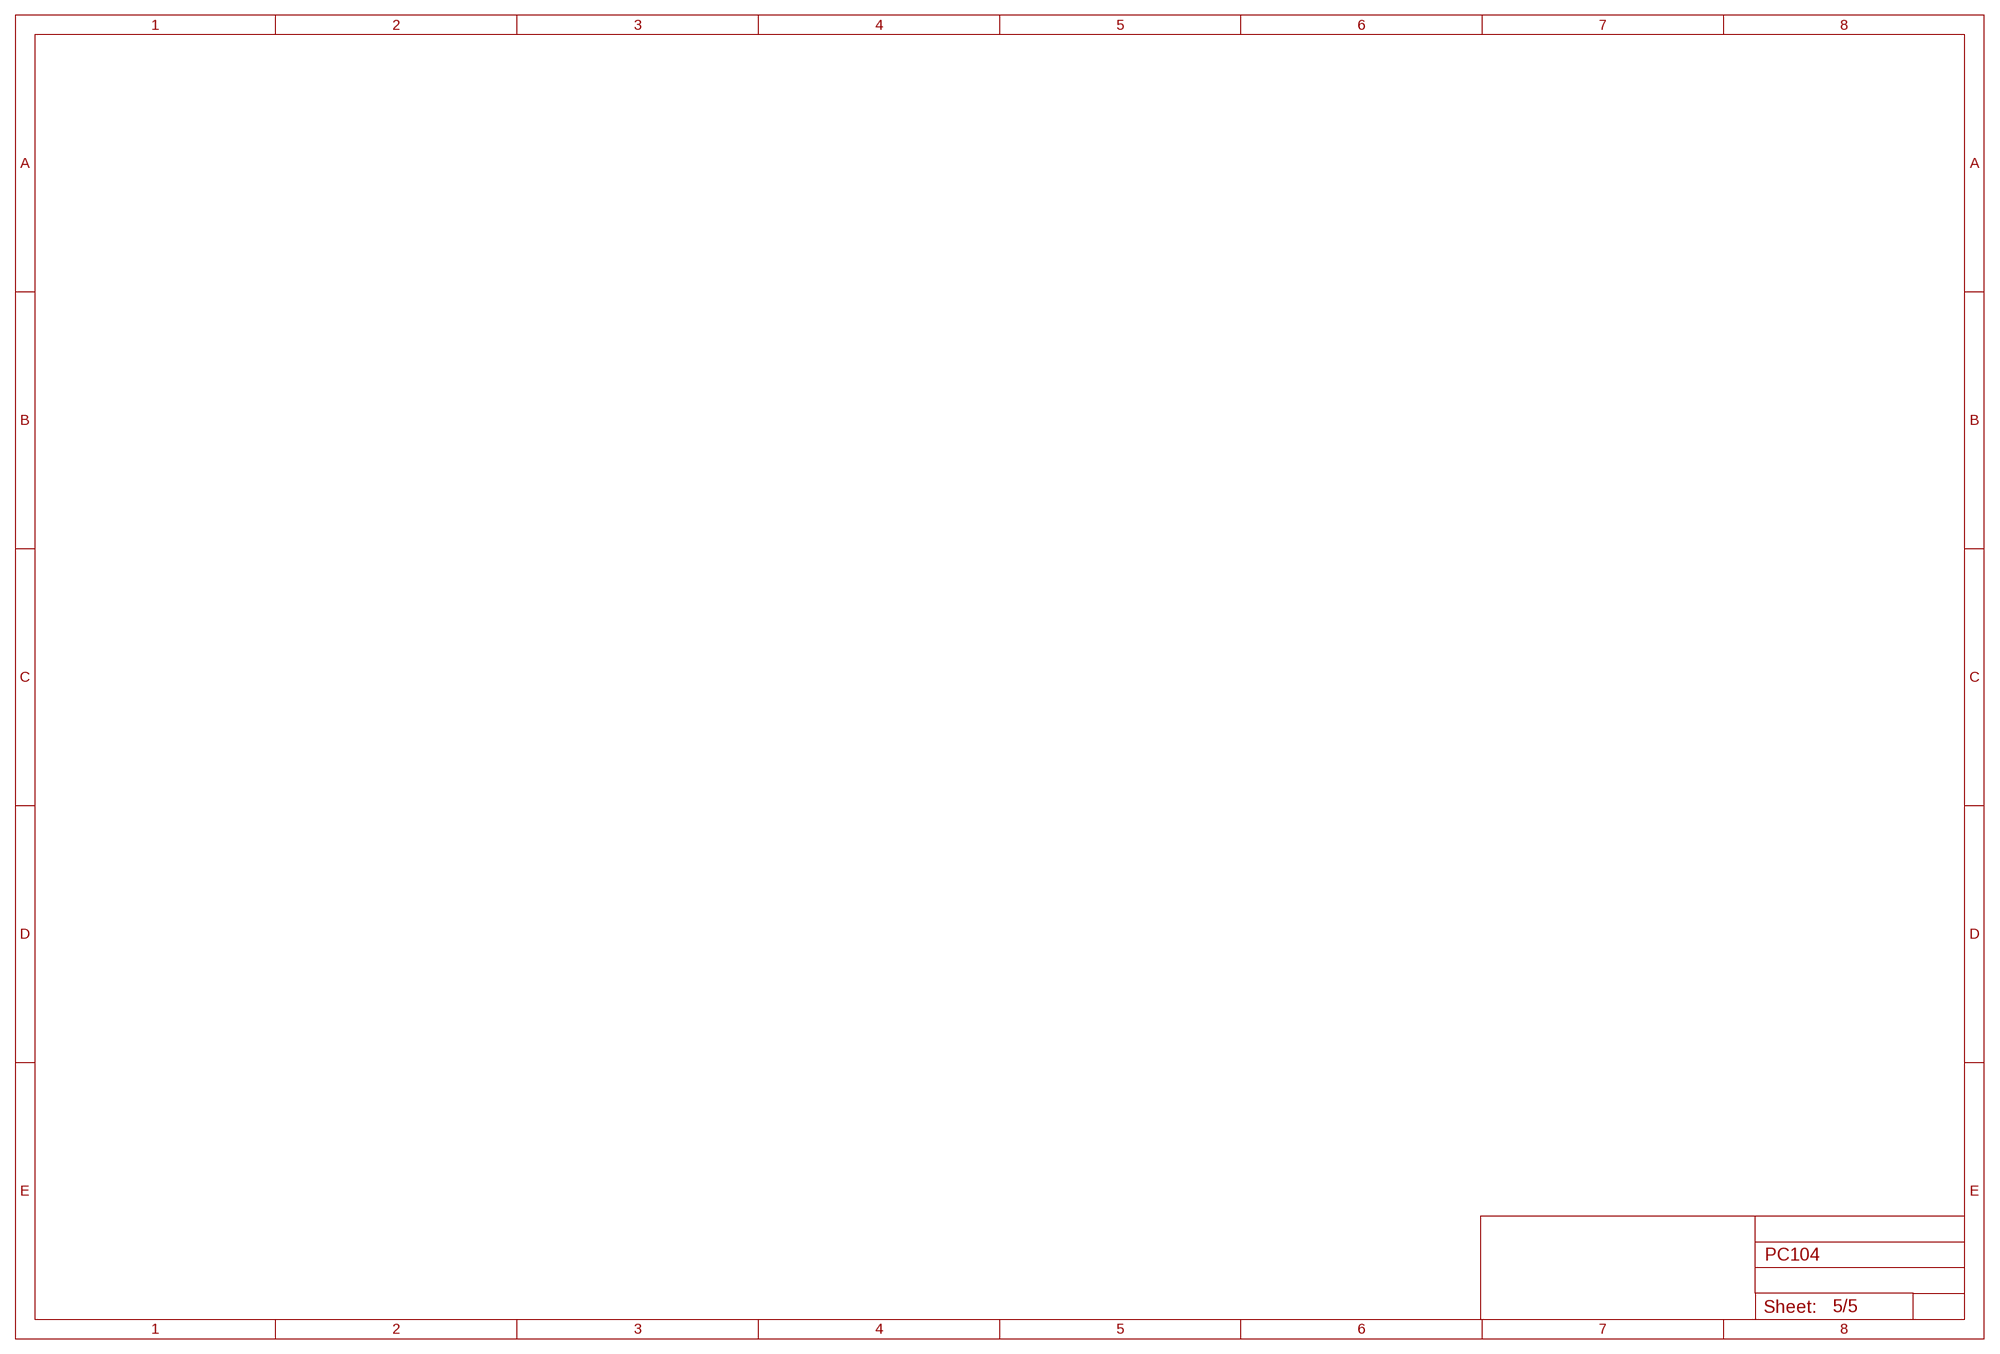
[diagram p4: schematic, sheet 5]

## Library data of the parts
3V3_S A_DRDY A_MAG_CS F-CTS F-RTS F-SIO F-SLK F-SWD G_A_MAG_CS G_CS G_DRDY GND IO-CLK IO-DIO IO-L-SAF IO-SWD M_DRDY MISO MOSI P_SENS R2IN_2 R2O_1 RSSI-IN SAF SCK SD1 SD2 SYNC SYNC1 T2IN_1 T2O_2 VBUS_V VDD_BV VDD_SV = pixhawk2:PAD: Test pad This footprint includes three classes: The actual test pads, a pogo-pin footprint to mount the pogo-pin as through-hole part and a hole footprint which allows the head of the pogo-pin to pass through (do NOT use the hole to mount the pogo-pin). In a typical test setup, the stack would consist of three PCBs: The actual PCB under testing with a test pad on the bottom, then a second PCB with the hole for the pogo-pin head where the PCB under testing is pressed on and a third PCB at 30 mm / 1.2" distance with the pogo-pin footprints. The pogo-pins are soldered to the last PCB. To create the stack, copy the board under testing and exchange the footprints - this way the correct positioning is ensured.
B101 = pixhawk2:MS621FE: SEIKO 6.8mm Rechargeable 3V lithium battery If discontinued or not available, similar devices are available from Panasonic and Sanyo, usually direct replacements.; DATASHEET: http://speed.sii.co.jp/data/file_PRODUCT_MASTER_50112_TITLE_IMAGESP.pdf; LINK: http://search.digikey.com/us/en/products/MS621FE-FL11E/728-1057-ND/1889208; MFGPN: MS621FE
C101-C114 C201-C215 C301-C328 C401-C434 = pixhawk2:CAP: Capacitor Standard 0603 ceramic capacitor, and 0.1" leaded capacitor.
D101 D401-D404 D407 = pixhawk2:DIODE-SCHOTTKY: Schottky barrier diode in DO214AC, e.g. Fairchild SS14.
D102 D301 D303 D305 = pixhawk2:DIODE-TVS
D306 D307 D309 = diode:PESD1CAN: CAN bus ESD protection diode Source: http://www.nxp.com/documents/data_sheet/PESD1CAN.pdf
D405 D406 = diode:DIODE-2AC|CA: Dual DIODE Anode-Cathode|Cathode-Anode
J101 J301 J302 J304-J311 J401-J407 = pixhawk2:HEADER_1X4
J102 = pixhawk2:DF13-2P-1.25?
J103 = pixhawk2:DF13-7P-1.25?
L101 = pixhawk2:INDUCTOR: Inductors Basic Inductor/Choke - 0603 and 1210. Footprints are not proven and vary greatly between part numbers. SRR1210: Bourns SRR1210 parts, e.g. SRR1210-100M
L102 L303 L304 L306 L403-L405 = pixhawk2:KNH16C104DA5TS: Kyocera KNH16C104DA5TS EMI filter
L401 L402 = SLF10145:SLF10145: SMD Power Inductor Component Size : Mount Area : 10.1mm x 10.1mm Low Profile : 4.8mm Max. Height
LED101 LED102 LED301-LED303 LED401 LED402 = pixhawk2:LED: LEDs Standard schematic elements and footprints for 5mm, 3mm, 1206, and 0603 sized LEDs. 5mm - Spark Fun Electronics SKU : COM-00529 (and others)
Q201 = transistor-pnp:MMBT3906*: PNP Transistror
R101-R119 R201-R205 R301-R308 R310-R329 R401-R433 = pixhawk2:RESISTOR: Resistor Basic schematic elements and footprints for 0603, 1206, and PTH 1/10th watt (small) resistors.
S101 S301 = pixhawk2:SWITCH-MOMENTARY-2
U101 = pixhawk2:STM32F4X7VX: STM32F4X7VX 100 pin LQFP STM32F407VE - 512 KB flash, no crypto STM32F407VG - 1 MB flash, no crypto STM32F417VE - 512 KB flash, with crypto STM32F417VG - 1 MB flash, with crypto
U102 = pixhawk2:FM25V01: FM25V01 128Kb Serial 3V F-RAM Memory; DATASHEET: http://www.ramtron.com/files/datasheets/FM25V01_ds.pdf; LINK: http://www.digikey.com/product-detail/en/FM25V01-GTR/1140-1026-1-ND/2809832; MFGPN: FM25V01
U103 = baseboard:MICROSDSDI
U104 = pixhawk2:LT3469: LT3469 Piezo microactuator driver with boost regulator
U105 = pixhawk2:NUF2042XV6
U201 = pixhawk2:L3G4200DH: L3G4200DH - Digital 3-axis Gyroscope The L3G4200DH is a low-power three-axis angular rate sensor. The L3G4200DH has a full scale of ±250/±500/ ±2000 dps and is capable of measuring rates with a user-selectable bandwidth. It can operate within a temperature range from -40 °C to +85 °C. Supply voltage: 2.4 V to 3.6 V. Full datasheet: L3G4200DH Datasheet <http://www.st.com/stonline/products/literature/ds/17300.pdf>
U202 = ICM20609:ICM20609: ICM20609
U203 = pixhawk2:MPU-6000: Invensense MPU-6000: 3-axis gyro, 3-axis accel & 9-axis MotionFusion The MPU-60X0 Motion Processing Unit (MPU?) is the world?s first motion processing solution with integrated 9-axis sensor fusion for handset and tablet applications, game controllers, motion pointer remote controls, and other consumer devices. The MPU-60X0 has an embedded 3-axis MEMS gyroscope, 3-axis MEMS accelerometer and Digital Motion Processor? (DMP) hardware accelerator engine with an auxiliary I 2 C port that interfaces to third party digital sensors, such as magnetometers. Interfacing with a 3-axis magnetometer delivers a complete 9-axis sensor fusion output to the MPU?s primary I 2 C or SPI port. (SPI is available on MPU-6000 only). This combines acceleration and rotational motion plus heading information into a single data stream for the application; DATASHEET: http://invensense.com/mems/gyro/documents/PS-MPU-6000A-00_v1.0.pdf; LINK: http://invensense.com/mems/gyro/mpu6000.html; MFGPN: MPU-6000
U204 = pixhawk2:MPU-6500: MPU-9250
U205 = pixhawk2:MS5611-01BA: MS5611-01BA The MS5611-01BA is a new generation of high resolution altimeter sensors from MEAS Switzerland with SPI and I 2 C bus interface. It is optimized for altimeters and variometers with an altitude resolution of 10 cm. The sensor module includes a high linearity pressure sensor and an ultra low power 24 bit ?? ADC with internal factory calibrated coefficients. It provides a precise digital 24 Bit pressure and temperature value and different operation modes that allow the user to optimize for conversion speed and current consumption. A high resolution temperature output allows the implementation of an altimeter/thermometer function without any additional sensor. The MS5611-01BA can be interfaced to virtually any microcontroller. The communication protocol is simple, without the need of programming internal registers in the device. Small dimensions of only 5.0 mm x 3.0 mm and a height of 1.7 mm allow for integration in mobile devices. This new sensor module generation is based on leading MEMS technology and latest benefits from MEAS Switzerland proven experience and know-how in high volume manufacturing of altimeter modules, which have been widely used for over a decade. The sensing principle employed leads to very low hysteresis and high stability of both pressure and temperature signal. High resolution module, 10 cm Fast conversion down to 1 ms Low power, 1 µA (standby < 0.15 µA) QFN package 5.0 x 3.0 x 1.7 mm3 Supply voltage 1.8 to 3.6 V Integrated digital pressure sensor (24 bit ?? ADC) Operating range: 10 to 1200 mbar, -40 to +85 °C I2C and SPI interface up to 20 MHz No external components (Internal oscillator) Excellent long term stability; DATASHEET: http://www.meas-spec.com/downloads/MS5611-01BA01.pdf; LINK: http://www.meas-spec.com/product/t_product.aspx?id=8503#; MFGPN: MS5611-01BA
U301 = pixhawk2:STM32F10XCXT6: ST STM32F101/103 48pin LQFP
U302 U305 = analog-devices:ADUM1301: Triple-Channel Digital Isolators Source: http://www.analog.com/static/imported-files/data_sheets/ADuM1300_1301.pdf; MPN: ADUM1301BRWZ; OC_FARNELL: 1465623; OC_NEWARK: 19M0757
U303 U304 = pixhawk2:MAX3051: 3.3-V CAN TRANSCEIVER
U306 U408 = pixhawk2:TXS0108
U307 = maxim:MAX481CSA: RS485 TRANSEIVER; MF: MAXIM; MPN: MAX481CSA; OC_FARNELL: unknown; OC_NEWARK: 90C3817
U308 = maxim:MAX232ECWE: RS232 TRANSCEIVER; MF: MAXIM; MPN: MAX232ECWE+; OC_FARNELL: 9724435; OC_NEWARK: 67K4440
U401 U402 = national-semiconductor:LM5005: High Voltage Monolithic Two-Switch Forward DC-DC Regulator Source: http://cache.national.com/ds/LM/LM5015.pdf; MPN: LM5015MH/NOPB; OC_FARNELL: 1535370; OC_NEWARK: 64M7033
U403 U404 = pixhawk2:BQ24315
U405-U407 = pixhawk2:LD1117A: LD1117A LDO Datasheet: http://www.st.com/stonline/books/pdf/docs/7194.pdf
U$1-U$4 = pixhawk2:MOUNT-HOLE
X101 X301 = pixhawk2:OSCILLATOR: Crystal Oscillator in 3.2x2.5 SMD

## Net classes
0 GND: width 0.127 mm, drill 0.102 mm, clearance 0.205 mm
1 GND1: width 0.127 mm, drill 0.102 mm, clearance 0.205 mm to class 0, clearance 0.127 mm